# Altium schematic sheet Sheet1.SchDoc
size A; SheetNumber: 1; SheetTotal: 1
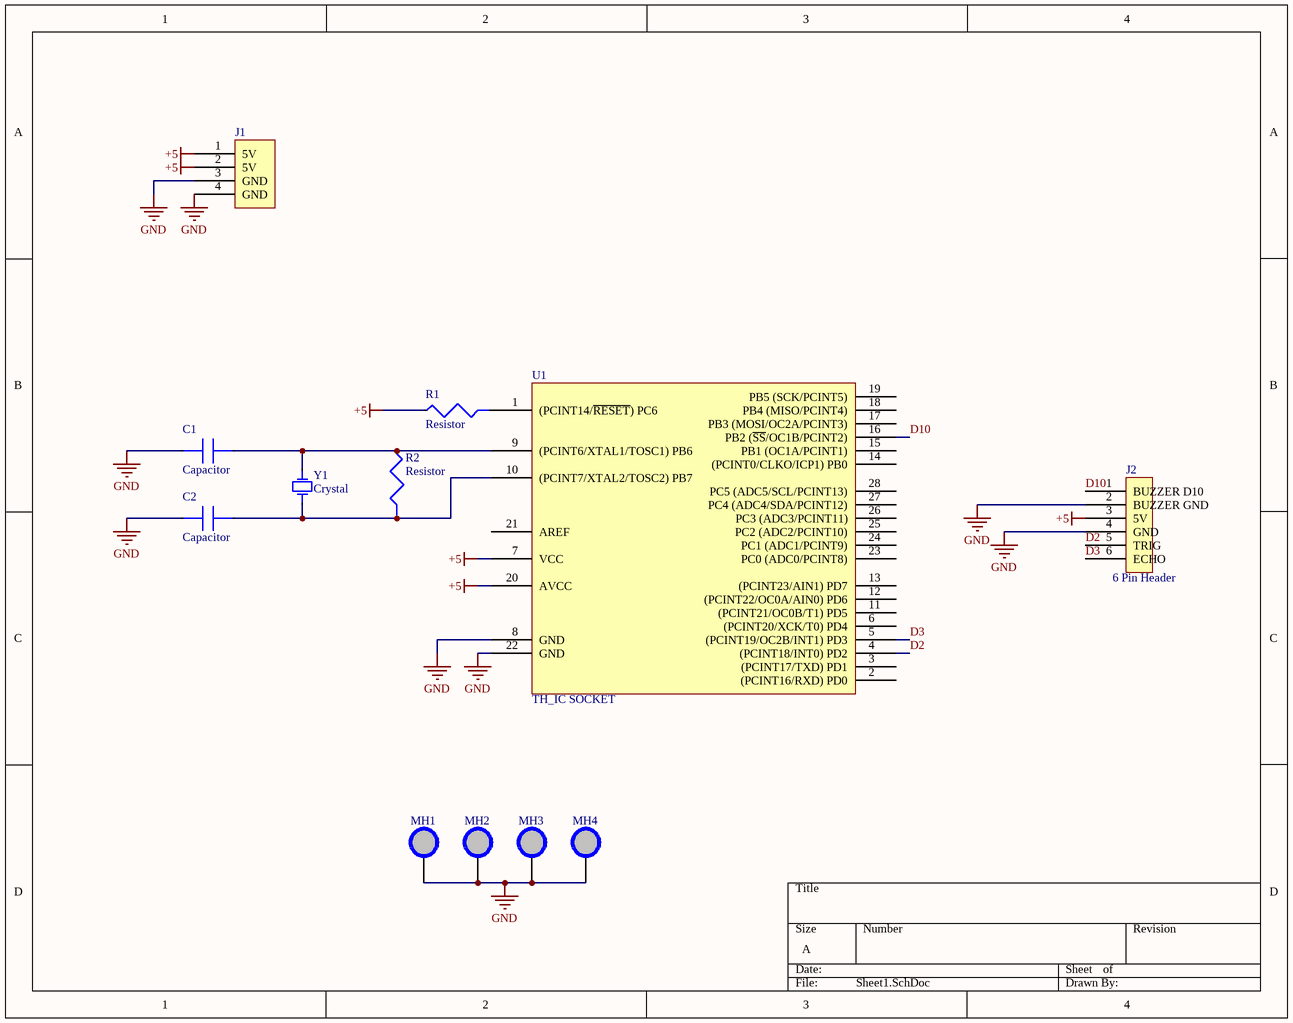
[diagram p0: Sheet1.SchDoc]

## Parts
C1  Capacitor  [Capacitor TH]
C2  Capacitor  [Capacitor TH]
J1  4 Pin Header, 1 Row, Female, 2.54mm Pitch  [4 Pin Header]  (value not drawn)
J2  6 Pin Header  [6 PIN HEADER]
MH1  Mounting Hole  [Mounting Hole]  (value not drawn)  (no BOM)
MH2  Mounting Hole  [Mounting Hole]  (value not drawn)  (no BOM)
MH3  Mounting Hole  [Mounting Hole]  (value not drawn)  (no BOM)
MH4  Mounting Hole  [Mounting Hole]  (value not drawn)  (no BOM)
R1  Resistor  [Resistor]
R2  Resistor  [Resistor]
U1  TH_IC SOCKET  [28dip_through_hole_ic_socket]
Y1  Crystal  [Crystal]

## Nets
+5: J1.1(5V) J1.2(5V) J2.3(5V) R1.2 U1.7(VCC) U1.20(AVCC)
GND: C1.1 C2.1 J1.3(GND) J1.4(GND) J2.2(BUZZER_GND) J2.4(GND) MH1.1 MH2.1 MH3.1 MH4.1 U1.8(GND) U1.22(GND)
D2: J2.5(TRIG) U1.4((PCINT18/INT0)_PD2)
D3: J2.6(ECHO) U1.5((PCINT19/OC2B/INT1)_PD3)
D10: J2.1(BUZZER_D10) U1.16(PB2_(~{SS}/OC1B/PCINT2))
NetC1_2: C1.2 R2.2 U1.9((PCINT6/XTAL1/TOSC1)_PB6) Y1.1
NetC2_2: C2.2 R2.1 U1.10((PCINT7/XTAL2/TOSC2)_PB7) Y1.2
NetR1_1: R1.1 U1.1((PCINT14/~{RESET})_PC6)

Not connected (* = marked no-connect by the designer): U1 2((PCINT16/RXD)_PD0) 3((PCINT17/TXD)_PD1) 6((PCINT20/XCK/T0)_PD4) 11((PCINT21/OC0B/T1)_PD5) 12((PCINT22/OC0A/AIN0)_PD6) 13((PCINT23/AIN1)_PD7) 14((PCINT0/CLKO/ICP1)_PB0) 15(PB1_(OC1A/PCINT1)) 17(PB3_(MOSI/OC2A/PCINT3)) 18(PB4_(MISO/PCINT4)) 19(PB5_(SCK/PCINT5)) 21(AREF) 23(PC0_(ADC0/PCINT8)) 24(PC1_(ADC1/PCINT9)) 25(PC2_(ADC2/PCINT10)) 26(PC3_(ADC3/PCINT11)) 27(PC4_(ADC4/SDA/PCINT12)) 28(PC5_(ADC5/SCL/PCINT13))

## Library data of the parts
J1 = M20-7820446: 4 Pin Header Board Connector, 4 Contact(s), 1 Row(s), Female, Straight, 0.1 inch Pitch, Solder Terminal, Locking, Black Insulator, Socket; Manufacturer: Harwin; Option: General Purpose; Contact Pattern: RECTANGULAR; Contact Resistance: 20mR; Contact Style: SQ PIN-SKT; Dielectric Withstanding Voltage (AC): 1kV; Durability: 300Cycles; Filter Feature: No; Insulation Resistance: 1GR; Number Of Connectors: 1; Polarization Key: POLARIZED HOUSING; Rated Current (Signal): 3A; Number of Contacts: 4; Body Breadth: 0.098inch; Body Depth: 0.335inch; Body Length: 0.4inch; Reference Standard: UL; Reliability: COMMERCIAL; Supplier: Digi-Key; Supplier Part Number: 952-1792-ND; Manufacturer Part Number: M20-7820446; RoHS: Yes; Category: Headers and Wire Housings; Stock: 3461; Pricing: 1=1.02, 10=0.859, 100=0.771, 500=0.63084, 1000=0.56075, 5000=0.49066, 10000=0.46613 (USD); Mounting Technology: Board; Contact Finish - Mating: TIN; Contact Finish - Termination: TIN; Insulation Color: Black; Insulation Material: Polyamide; Min Operating Temperature: -40°C; Max Operating Temperature: 105°C; Connector Type: BOARD CONNECTOR; JESD-609 Code: e3; Body/Shell Style: SOCKET; Contact Gender: Female; Mixed Contacts: No; Mounting Style: STRAIGHT; Number Of PCB Rows: 1; Number of Rows Loaded: 1; PCB Contact Pattern: RECTANGULAR; Termination: Solder; Mating Contact Pitch: 0.1inch; Mounting Option 1: LOCKING; Terminal Length: 0.118inch; Terminal Pitch: 2.54mm; Flammability Rating: UL94 V-0; DIN Conformance: No; IEC Conformance: No; MIL Conformance: No; Reach SVHC Compliant: Yes; RoHS Compliant: Yes; ComponentLink1URL: https://datasheet.ciiva.com:443/pdfs/VipMasterIC/IC/HRWN/HRWN-S-A0004894635/HRWN-S-A0004894635-1.pdf?src-supplier=IHS+Markit; ComponentLink1Description: https://datasheet.ciiva.com:443/pdfs/VipMasterIC/IC/HRWN/HRWN-S-A0004894635/HRWN-S-A0004894635-1.pdf?src-supplier=IHS+Markit; ComponentLink2URL: https://datasheet.ciiva.com/11747/0900766b80dc1d2b-11747084.pdf?src-supplier=Rs; ComponentLink2Description: https://datasheet.ciiva.com/11747/0900766b80dc1d2b-11747084.pdf?src-supplier=Rs; ComponentLink3URL: https://datasheet.ciiva.com/6784/m20-782-6784360.pdf?src-supplier=Digi-Key; ComponentLink3Description: https://datasheet.ciiva.com/6784/m20-782-6784360.pdf?src-supplier=Digi-Key; ComponentLink4URL: https://datasheet.ciiva.com/7639/1836950-7639727.pdf?src-supplier=Element14; ComponentLink4Description: https://datasheet.ciiva.com/7639/1836950-7639727.pdf?src-supplier=Element14; ComponentLink5URL: https://datasheet.ciiva.com/10151/m20-782-10151359.pdf?src-supplier=Avnet; ComponentLink5Description: https://datasheet.ciiva.com/10151/m20-782-10151359.pdf?src-supplier=Avnet
J2 = 929850-01-06-RB: 6 Pin Header Board Connector; Manufacturer: 3M; Manufacturer Series: 929; Supplier: Mouser; Supplier Part Number: 517-929850-01-06-RB; Manufacturer Part Number: 929850-01-06-RB; RoHS: Yes; Category: Headers and Wire Housings; Stock: 258; Pricing: 1=2.56, 10=2.08, 50=2.08, 100=1.99, 1000=1.42, 10000=1.26 (USD); Connector Type: BOARD CONNECTOR; Reach SVHC Compliant: Yes; RoHS Compliant: Yes; ComponentLink1URL: https://datasheet.ciiva.com:443/pdfs/VipMasterIC/IC/IIIM/IIIMS03618/IIIMS03618-1.pdf?src-supplier=IHS+Markit; ComponentLink1Description: https://datasheet.ciiva.com:443/pdfs/VipMasterIC/IC/IIIM/IIIMS03618/IIIMS03618-1.pdf?src-supplier=IHS+Markit; ComponentLink2URL: https://datasheet.ciiva.com/5148/ts0815-5148223.pdf?src-supplier=Mouser; ComponentLink2Description: https://datasheet.ciiva.com/5148/ts0815-5148223.pdf?src-supplier=Mouser; ComponentLink3URL: https://datasheet.ciiva.com/756/ts0815-756418.pdf?src-supplier=Digi-Key; ComponentLink3Description: https://datasheet.ciiva.com/756/ts0815-756418.pdf?src-supplier=Digi-Key
U1 = ICS-328-T: Through Hole IC Sockets 28P / .300"; Manufacturer: Adam Equipment; Supplier: Arrow Electronics; Supplier Part Number: ICS-328-T; Manufacturer Part Number: ICS-328-T; RoHS: Yes; Category: IC and Component Sockets; Stock: 603; Pricing: 1=0.1941, 17=0.1922, 34=0.1565, 51=0.1549, 85=0.1534, 238=0.139, 442=0.1333, 952=0.1182 (USD); ComponentLink1URL: https://datasheet.ciiva.com/16210/page-187-188-16210500.pdf?src-supplier=Future+Electronics; ComponentLink1Description: https://datasheet.ciiva.com/16210/page-187-188-16210500.pdf?src-supplier=Future+Electronics